# Altium schematic sheet Esquema_V3.SchDoc
size A3; SheetNumber: 1; SheetTotal: 2
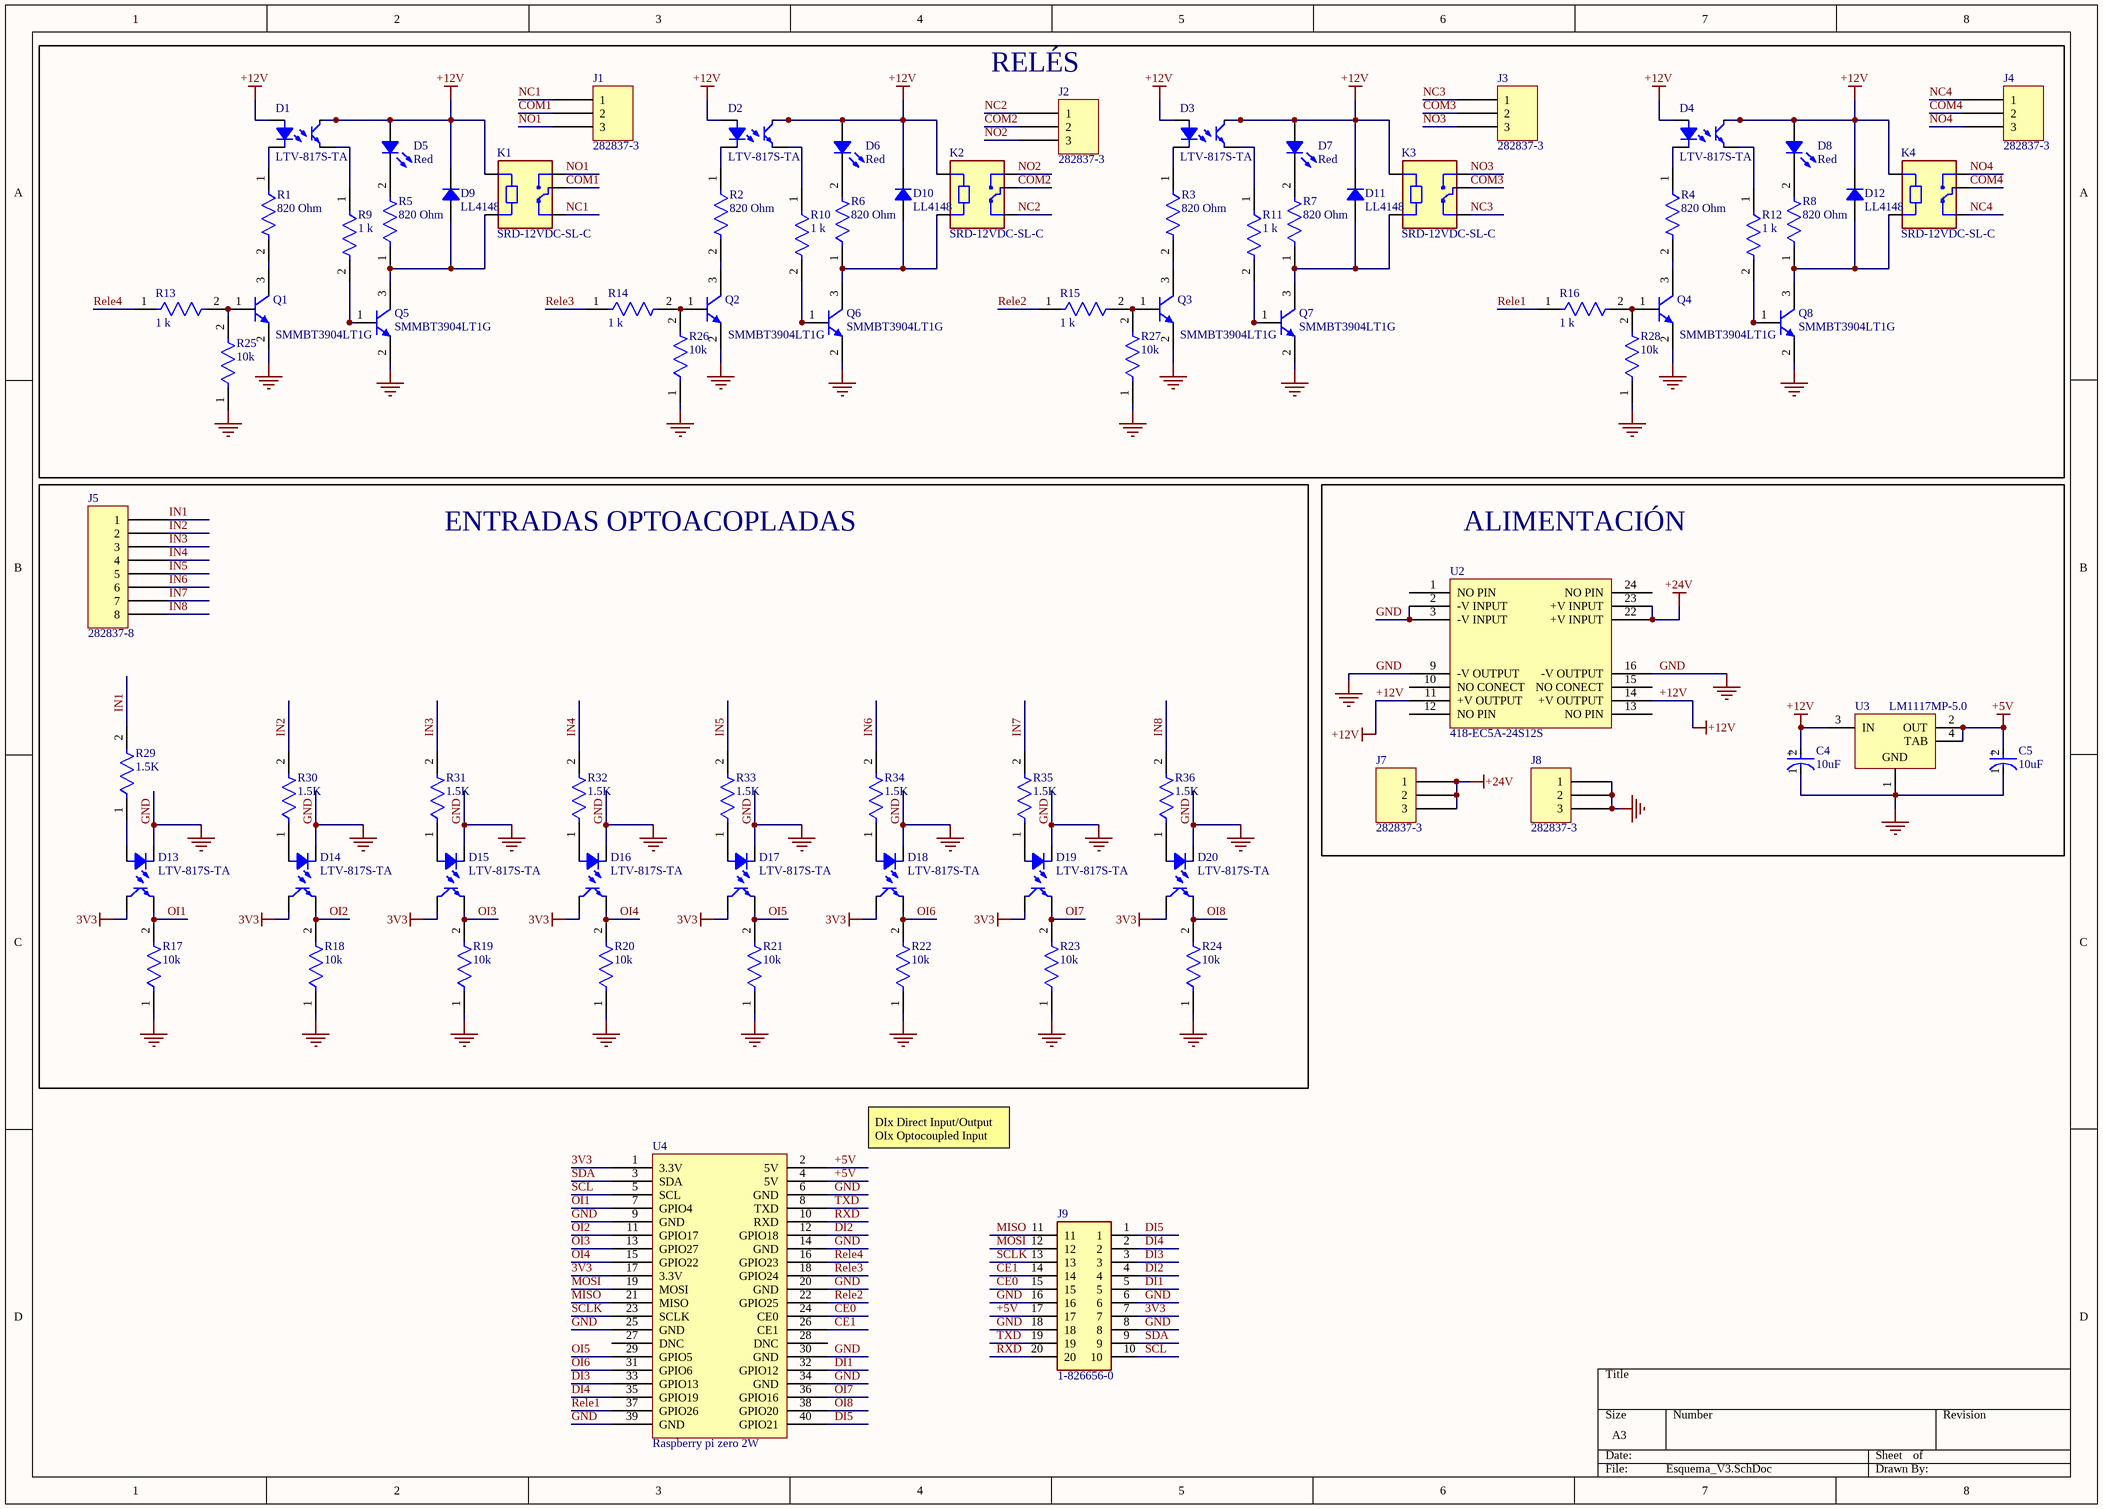
[diagram p0: Esquema_V3.SchDoc]

## Parts
C4  10uF  [FP-TAJA-MFG]
C5  10uF  [FP-TAJA-MFG]
D1  LTV-817S-TA  [LITEON LTV-817]
D2  LTV-817S-TA  [LITEON LTV-817]
D3  LTV-817S-TA  [LITEON LTV-817]
D4  LTV-817S-TA  [LITEON LTV-817]
D5  Red  [LED 1206_3216 RED]
D6  Red  [LED 1206_3216 RED]
D7  Red  [LED 1206_3216 RED]
D8  Red  [LED 1206_3216 RED]
D9  LL4148  [SOD-80 MiniMELF]
D10  LL4148  [SOD-80 MiniMELF]
D11  LL4148  [SOD-80 MiniMELF]
D12  LL4148  [SOD-80 MiniMELF]
D13  LTV-817S-TA  [LITEON LTV-817]
D14  LTV-817S-TA  [LITEON LTV-817]
D15  LTV-817S-TA  [LITEON LTV-817]
D16  LTV-817S-TA  [LITEON LTV-817]
D17  LTV-817S-TA  [LITEON LTV-817]
D18  LTV-817S-TA  [LITEON LTV-817]
D19  LTV-817S-TA  [LITEON LTV-817]
D20  LTV-817S-TA  [LITEON LTV-817]
J1  282837-3  [TE 282837-3]
J2  282837-3  [TE 282837-3]
J3  282837-3  [TE 282837-3]
J4  282837-3  [TE 282837-3]
J5  282837-8  [TE 282837-8]
J7  282837-3  [TE 282837-3]
J8  282837-3  [TE 282837-3]
J9  1-826656-0  [TE_1-826656-0]
K1  SRD-12VDC-SL-C  [RELAY_SRD-05VDC-SL-C]
K2  SRD-12VDC-SL-C  [RELAY_SRD-05VDC-SL-C]
K3  SRD-12VDC-SL-C  [RELAY_SRD-05VDC-SL-C]
K4  SRD-12VDC-SL-C  [RELAY_SRD-05VDC-SL-C]
Q1  SMMBT3904LT1G  [ONSC-SOT-23-3-318-08_V]
Q2  SMMBT3904LT1G  [ONSC-SOT-23-3-318-08_V]
Q3  SMMBT3904LT1G  [ONSC-SOT-23-3-318-08_V]
Q4  SMMBT3904LT1G  [ONSC-SOT-23-3-318-08_V]
Q5  SMMBT3904LT1G  [ONSC-SOT-23-3-318-08_V]
Q6  SMMBT3904LT1G  [ONSC-SOT-23-3-318-08_V]
Q7  SMMBT3904LT1G  [ONSC-SOT-23-3-318-08_V]
Q8  SMMBT3904LT1G  [ONSC-SOT-23-3-318-08_V]
R1  820 Ohm  [FP-CRCW0603-HPe3-MFG]
R2  820 Ohm  [FP-CRCW0603-HPe3-MFG]
R3  820 Ohm  [FP-CRCW0603-HPe3-MFG]
R4  820 Ohm  [FP-CRCW0603-HPe3-MFG]
R5  820 Ohm  [FP-CRCW0603-HPe3-MFG]
R6  820 Ohm  [FP-CRCW0603-HPe3-MFG]
R7  820 Ohm  [FP-CRCW0603-HPe3-MFG]
R8  820 Ohm  [FP-CRCW0603-HPe3-MFG]
R9  1 k  [FP-MCT0603-IPC_C]
R10  1 k  [FP-MCT0603-IPC_C]
R11  1 k  [FP-MCT0603-IPC_C]
R12  1 k  [FP-MCT0603-IPC_C]
R13  1 k  [FP-MCT0603-IPC_C]
R14  1 k  [FP-MCT0603-IPC_C]
R15  1 k  [FP-MCT0603-IPC_C]
R16  1 k  [FP-MCT0603-IPC_C]
R17  10k  [FP-MCT0603-IPC_B]
R18  10k  [FP-MCT0603-IPC_B]
R19  10k  [FP-MCT0603-IPC_B]
R20  10k  [FP-MCT0603-IPC_B]
R21  10k  [FP-MCT0603-IPC_B]
R22  10k  [FP-MCT0603-IPC_B]
R23  10k  [FP-MCT0603-IPC_B]
R24  10k  [FP-MCT0603-IPC_B]
R25  10k  [FP-MCT0603-IPC_B]
R26  10k  [FP-MCT0603-IPC_B]
R27  10k  [FP-MCT0603-IPC_B]
R28  10k  [FP-MCT0603-IPC_B]
R29  1.5K  [FP-CRCW0603-e3-IPC_C]
R30  1.5K  [FP-CRCW0603-e3-IPC_C]
R31  1.5K  [FP-CRCW0603-e3-IPC_C]
R32  1.5K  [FP-CRCW0603-e3-IPC_C]
R33  1.5K  [FP-CRCW0603-e3-IPC_C]
R34  1.5K  [FP-CRCW0603-e3-IPC_C]
R35  1.5K  [FP-CRCW0603-e3-IPC_C]
R36  1.5K  [FP-CRCW0603-e3-IPC_C]
U2  418-EC5A-24S12S  [418-EC5A-24S12S]
U3  LM1117MP-5.0  [MP04A_N]
U4  Raspberry pi zero 2W  [PCBComponent_1]

## Blocks framed on the sheet
RELÉS: D1-D12 J1-J4 K1-K4 Q1-Q8 R1-R16 R25-R28
ENTRADAS OPTOACOPLADAS: D13-D20 J5 R17-R24 R29-R36
ALIMENTACIÓN: C4 C5 J7 J8 U2 U3

## Nets
3V3: D13.4 D14.4 D15.4 D16.4 D17.4 D18.4 D19.4 D20.4 J9.7 U4.1(3.3V) U4.17(3.3V)
+5V: C5.2(A) J9.17 U3.2(OUT) U3.4(TAB) U4.2(5V) U4.4(5V)
+12V: C4.2(A) D1.1 D1.4 D2.1 D2.4 D3.1 D3.4 D4.1 D4.4 D5.1 D6.1 D7.1 D8.1 D9.2 D10.2 D11.2 D12.2 K1.A1 K2.A1 K3.A1 K4.A1 U2.11(+V_OUTPUT) U2.14(+V_OUTPUT) U3.3(IN)
+24V: J7.1 J7.2 J7.3 U2.22(+V_INPUT) U2.23(+V_INPUT)
GND: C4.1(C) C5.1(C) D13.2 D14.2 D15.2 D16.2 D17.2 D18.2 D19.2 D20.2 J8.1 J8.2 J8.3 J9.6 J9.8 J9.16 J9.18 Q1.2(E) Q2.2(E) Q3.2(E) Q4.2(E) Q5.2(E) Q6.2(E) Q7.2(E) Q8.2(E) R17.1 R18.1 R19.1 R20.1 R21.1 R22.1 R23.1 R24.1 R25.1 R26.1 R27.1 R28.1 U2.2(-V_INPUT) U2.3(-V_INPUT) U2.9(-V_OUTPUT) U2.16(-V_OUTPUT) U3.1(GND) U4.6(GND) U4.9(GND) U4.14(GND) U4.20(GND) U4.25(GND) U4.30(GND) U4.34(GND) U4.39(GND)
CE0: J9.15 U4.24(CE0)
CE1: J9.14 U4.26(CE1)
COM1: J1.2 K1.COM
COM2: J2.2 K2.COM
COM3: J3.2 K3.COM
COM4: J4.2 K4.COM
DI1: J9.5 U4.32(GPIO12)
DI2: J9.4 U4.12(GPIO18)
DI3: J9.3 U4.33(GPIO13)
DI4: J9.2 U4.35(GPIO19)
DI5: J9.1 U4.40(GPIO21)
IN1: J5.1 R29.2
IN2: J5.2 R30.2
IN3: J5.3 R31.2
IN4: J5.4 R32.2
IN5: J5.5 R33.2
IN6: J5.6 R34.2
IN7: J5.7 R35.2
IN8: J5.8 R36.2
MISO: J9.11 U4.21(MISO)
MOSI: J9.12 U4.19(MOSI)
NC1: J1.1 K1.NC
NC2: J2.1 K2.NC
NC3: J3.1 K3.NC
NC4: J4.1 K4.NC
NO1: J1.3 K1.NO
NO2: J2.3 K2.NO
NO3: J3.3 K3.NO
NO4: J4.3 K4.NO
OI1: D13.3 R17.2 U4.7(GPIO4)
OI2: D14.3 R18.2 U4.11(GPIO17)
OI3: D15.3 R19.2 U4.13(GPIO27)
OI4: D16.3 R20.2 U4.15(GPIO22)
OI5: D17.3 R21.2 U4.29(GPIO5)
OI6: D18.3 R22.2 U4.31(GPIO6)
OI7: D19.3 R23.2 U4.36(GPIO16)
OI8: D20.3 R24.2 U4.38(GPIO20)
Rele1: R16.1 U4.37(GPIO26)
Rele2: R15.1 U4.22(GPIO25)
Rele3: R14.1 U4.18(GPIO24)
Rele4: R13.1 U4.16(GPIO23)
RXD: J9.20 U4.10(RXD)
SCL: J9.10 U4.5(SCL)
SCLK: J9.13 U4.23(SCLK)
SDA: J9.9 U4.3(SDA)
TXD: J9.19 U4.8(TXD)
NetD1_2: D1.2 R1.1
NetD1_3: D1.3 R9.1
NetD2_2: D2.2 R2.1
NetD2_3: D2.3 R10.1
NetD3_2: D3.2 R3.1
NetD3_3: D3.3 R11.1
NetD4_2: D4.2 R4.1
NetD4_3: D4.3 R12.1
NetD5_2: D5.2 R5.2
NetD6_2: D6.2 R6.2
NetD7_2: D7.2 R7.2
NetD8_2: D8.2 R8.2
NetD9_1: D9.1 K1.A2 Q5.3(C) R5.1
NetD10_1: D10.1 K2.A2 Q6.3(C) R6.1
NetD11_1: D11.1 K3.A2 Q7.3(C) R7.1
NetD12_1: D12.1 K4.A2 Q8.3(C) R8.1
NetD13_1: D13.1 R29.1
NetD14_1: D14.1 R30.1
NetD15_1: D15.1 R31.1
NetD16_1: D16.1 R32.1
NetD17_1: D17.1 R33.1
NetD18_1: D18.1 R34.1
NetD19_1: D19.1 R35.1
NetD20_1: D20.1 R36.1
NetQ1_1: Q1.1(B) R13.2 R25.2
NetQ1_3: Q1.3(C) R1.2
NetQ2_1: Q2.1(B) R14.2 R26.2
NetQ2_3: Q2.3(C) R2.2
NetQ3_1: Q3.1(B) R15.2 R27.2
NetQ3_3: Q3.3(C) R3.2
NetQ4_1: Q4.1(B) R16.2 R28.2
NetQ4_3: Q4.3(C) R4.2
NetQ5_1: Q5.1(B) R9.2
NetQ6_1: Q6.1(B) R10.2
NetQ7_1: Q7.1(B) R11.2
NetQ8_1: Q8.1(B) R12.2

Not connected (* = marked no-connect by the designer): U2 1(NO_PIN) 10(NO_CONECT) 12(NO_PIN) 13(NO_PIN) 15(NO_CONECT) 24(NO_PIN); U4 27(DNC) 28(DNC)

## Notes on the sheet
- DIx Direct Input/Output
  OIx Optocoupled Input
- (in symbol CMP-2000-07219-2) +

## Library data of the parts
C4 C5 = CMP-2000-07219-2: TAJA106M010RNJ 10uF 10V  ±20% 3Ω 1206  SMD Tantalum Capacitor; Polarity: Polar; ESR (Equivalent Series Resistance): 3R; Dissipation Factor: 6%; Leakage Current: 1uA; Construction: Flat; Packaging: Tape and Reel; Voltage Rating: 10V; Lead Free: Lead Free; Radiation Hardening: No; REACH SVHC: No SVHC; Termination: SMD/SMT; Case/Package: 1206; RoHS Compliant: Yes; Min Operating Temperature: -55°C; Depth: 1.6mm; Voltage Rating (DC): 10V; Series: TAJ; Capacitance: 10uF; Height: 1.6mm; Height - Seated (Max): 0.071inch; Tolerance: 20%; Package Quantity: 1; Voltage: 10V; Features: General Purpose; Max Operating Temperature: 125°C; Lead Pitch: 1.1mm; Dielectric Material: Tantalum; Width: 0.063inch; Mount: Surface Mount; Case Code (Metric): 3216; Case Code (Imperial): 1206; Length: 3.2mm; Number of Pins: 2
D1-D4 D13-D20 = LTV-817S-TA: OPTOISOLATR 5KV TRANSISTOR 4-SMD; Manufacturer: Lite-On Inc.; Current - DC Forward (If) (Max): 50mA; Current Transfer Ratio (Max): 600% @ 5mA; Current Transfer Ratio (Min): 50% @ 5mA; Input Type: DC; Number of Channels: 1; Rise / Fall Time (Typ): 4µs, 3µs; Vce Saturation (Max): 200mV; Voltage - Forward (Vf) (Typ): 1.2V; Voltage - Isolation: 5000Vrms; Voltage - Output (Max): 35V; Part Number: LTV-817S-TA; ComponentLink1Description: Datasheet; ComponentLink1URL: http://optoelectronics.liteon.com/upload/download/DS-70-96-0016/LTV-8X7%20series%20201610%20.pdf; ComponentLink2Description: DigiKey Link; ComponentLink2URL: http://digikey.com/product-detail/en/lite-on-inc/LTV-817S-TA/160-2038-1-ND/3711420; Current - Output / Channel: 50mA; Device Package: 4-SMD, Gull Wing; LastUpdated: 12/01/2020 21:59:02; Lifecycle Status: Active; Minimum Order: 1; Mounting Type: Surface Mount; Operating Temperature: -30°C ~ 110°C; Output Type: Transistor; Package / Case: 4-SMD, Gull Wing; Packaging: TapeAndReel; Part Status: Active; Price: 0.12; Series: -; Supplier 1: DigiKey; Supplier Part Number 1: 160-2038-1-ND; Supplier Device Package: 4-SMD
D5-D8 = LTST-C150KAKT: LED RED CLEAR SMD; Manufacturer: Lite-On Inc.; Configuration: Standard; Current - Test: 20mA; Lens Color: Colorless; Lens Size: 2.06mm x 1.60mm; Lens Style: Rectangle with Flat Top; Millicandela Rating: 55mcd; Viewing Angle: 130°; Voltage - Forward (Vf) (Typ): 2V; Wavelength - Dominant: 615nm; Wavelength - Peak: 621nm; Part Number: LTST-C150KAKT; Color: Red; ComponentLink1Description: Datasheet; ComponentLink1URL: //media.digikey.com/pdf/Data%20Sheets/Lite-On%20PDFs/LTST-C150KAKT.pdf; ComponentLink2Description: DigiKey Link; ComponentLink2URL: http://digikey.com/product-detail/en/lite-on-inc/LTST-C150KAKT/160-1402-1-ND/386755; Device Package: 1206 (3216 Metric); Height (Max): 1.10mm; LastUpdated: 03/06/2024 20:00:41; Lens Transparency: Clear; Lifecycle Status: Active; Minimum Order: 1; Mounting Type: Surface Mount; Package / Case: 1206 (3216 Metric); Packaging: TapeAndReel; PartId: 189; Part Status: Active; Price: 0.07; Series: -; Size / Dimension: 3.20mm L x 1.60mm W; Supplier 1: DigiKey; Supplier Part Number 1: 160-1402-1-ND; Value: Red
D9-D12 = LL4148: DIODE GEN PURP 100V 200MA SOD80; Manufacturer: ON Semiconductor; Current - Reverse Leakage @ Vr: 25nA @ 20V; Diode Type: Standard; Reverse Recovery Time (trr): 4ns; Speed: Small Signal =< 200mA (Io), Any Speed; Voltage - Forward (Vf) (Max) @ If: 1V @ 10mA; Part Number: LL4148; ComponentLink1Description: Datasheet; ComponentLink1URL: https://www.onsemi.com/pub/Collateral/LL4148-D.pdf; ComponentLink2Description: DigiKey Link; ComponentLink2URL: http://digikey.com/product-detail/en/on-semiconductor/LL4148/LL4148FSCT-ND/1923118; Current - Average Rectified (Io): 200mA; LastUpdated: 03/06/2024 20:05:39; Lifecycle Status: Active; Minimum Order: 1; Mounting Type: Surface Mount; Operating Temperature - Junction: -55°C ~ 175°C; Package / Case: DO-213AC, MINI-MELF, SOD-80; Packaging: TapeAndReel; PartId: 2621; Part Status: Active; Price: 0.02; Series: -; Supplier 1: DigiKey; Supplier Part Number 1: LL4148FSCT-ND; Supplier Device Package: SOD-80; Voltage - DC Reverse (Vr) (Max): 100V
J1-J4 J7 J8 = 282837-3: TERM BLK 3P SIDE ENT 5.08MM PCB; Manufacturer: TE Connectivity AMP Connectors; Current: 13.5 A; Mating Orientation: Horizontal with Board; Number of Levels: 1; Pitch: 0.200" (5.08mm); Positions Per Level: 3; Voltage: 300 V; Wire Gauge: 16-28 AWG; Wire Termination: Screw - Rising Cage Clamp; Part Number: 282837-3; Color: Green; ComponentLink1Description: Datasheet; ComponentLink1URL: https://www.te.com/commerce/DocumentDelivery/DDEController?Action=srchrtrv&DocNm=282837&DocType=Customer+Drawing&DocLang=English; ComponentLink2Description: DigiKey Link; ComponentLink2URL: https://www.digikey.com/en/products/detail/te-connectivity-amp-connectors/282837-3/2187974; Features: Interlocking (Side); LastUpdated: 21/06/2022 15:00:39; Lifecycle Status: Active; Minimum Order: 1; Mounting Type: Through Hole; Packaging: Tray; Part Status: Active; Price: 0.47; Series: Buchanan; Supplier 1: DigiKey; Supplier Part Number 1: A113321-ND
J5 = 282837-8: TERM BLK 8P SIDE ENT 5.08MM PCB; Manufacturer: TE Connectivity AMP Connectors; Current: 13.5 A; Mating Orientation: Horizontal with Board; Number of Levels: 1; Pitch: 0.200" (5.08mm); Positions Per Level: 8; Voltage: 300 V; Wire Gauge: 16-28 AWG; Wire Termination: Screw - Rising Cage Clamp; Part Number: 282837-8; Color: Green; ComponentLink1Description: Datasheet; ComponentLink1URL: https://www.te.com/commerce/DocumentDelivery/DDEController?Action=srchrtrv&DocNm=282837&DocType=Customer+Drawing&DocLang=English; ComponentLink2Description: DigiKey Link; ComponentLink2URL: https://www.digikey.com/en/products/detail/te-connectivity-amp-connectors/282837-8/2222331; Features: Interlocking (Side); LastUpdated: 21/06/2022 15:01:52; Lifecycle Status: Active; Minimum Order: 1; Mounting Type: Through Hole; Packaging: Bulk; Part Status: Active; Price: 1.64; Series: Buchanan; Supplier 1: DigiKey; Supplier Part Number 1: 282837-8-ND
J9 = 1-826656-0: Conn Unshrouded Header HDR 20 POS 2.54mm Solder ST Thru-Hole Box; MF: TE Connectivity; Purchase-URL: https://pricing.snapeda.com/search/part/1-826656-0/?ref=eda; Value: *; SnapEDA_Link: https://www.snapeda.com/parts/1-826656-0/TE%20Connectivity%20AMP%20Connectors/view-part/2881856/?ref=snap; Package: None; Availability: Good; Price: None; Check_prices: https://www.snapeda.com/parts/1-826656-0/TE%20Connectivity%20AMP%20Connectors/view-part/2881856/?ref=eda; MP: 1-826656-0
K1-K4 = SRD-05VDC-SL-C: 5V Trigger Relay Module For Arduino And Raspberry Pi 5V Trigger Relay Module For Arduino And Raspberry Pi; MF: Songle Relay; Check_prices: https://www.snapeda.com/parts/SRD-05VDC-SL-C/Songle+Relay/view-part/?ref=eda; Value: *; Availability: Not in stock; Price: None; Package: NON STANDARD-5 Songle Relay; MP: SRD-05VDC-SL-C; SnapEDA_Link: https://www.snapeda.com/parts/SRD-05VDC-SL-C/Songle+Relay/view-part/?ref=snap
Q1-Q8 = CMP-1048-00625-1: General Purpose Transistor, NPN Silicon, 3-Pin SOT-23, Pb-Free, Tape and Reel; Manufacturer: On Semiconductor; IC Continuous (A): 0.2; fT Min (MHz): 300; PackageDescription: 3-Pin Small Outline Transistor, Body 2.92 x 1.3 mm, Pitch 0.95 mm; Mounting Technology: Surface Mount; ComponentLink1Description: Manufacturer URL; DatasheetVersion: Rev. 12; PackageReference: SOT-23-3-318-08; ComponentLink1URL: http://www.onsemi.com/; ComponentLink3Description: Package Specification; RoHS: TRUE; PartNumber: SMMBT3904LT1G; Polarity: NPN; Packing: Tape and Reel; ComponentLink2URL: http://www.onsemi.cn/pub_link/Collateral/MMBT3904LT1-D.PDF; PackageVersion: Rev. AP, 11/2009; ComponentLink2Description: Datasheet; ComponentLink3URL: http://www.onsemi.cn/pub_link/Collateral/318-08.PDF
R1-R8 = CMP-02407-003128-1: RES Thick Film, 820Ω, 1%, 0.33W, 100ppm/°C, 0603; Voltage Rating: 75V; Max Power Dissipation: 250mW; Resistance: 820R; Temperature Coefficient: 100ppm/°C; Termination: SMD/SMT; Military Standard: Not; Features: Automotive AEC-Q200; Composition: Thick Film; Voltage Rating (DC): 75V; Contact Plating: Tin; Package Quantity: 1; Case Code (Metric): 1608; Width: 0.033inch; Case/Package: 0603; Packaging: Tape and Reel; Depth: 0.85mm; Lead Free: Lead Free; Tolerance: 1%; Length: 1.6mm; Power Rating: 250mW; Weight: 7.1E-05oz; Case Code (Imperial): 0603; Radiation Hardening: No; Number of Terminations: 2; Max Operating Temperature: 155°C; Height: 0.45mm; Min Operating Temperature: -55°C
R9-R16 = CMP-02407-000265-1: MCT0603PD1001DP500 RES SMD 100 OHM 1% 1/8W 0603; Resistance: 1kR; Temperature Coefficient: 25ppm/°C; Tolerance: 0.5%; Max Power Dissipation: 250mW; Case Code (Metric): 1608; Case Code (Imperial): 0603; Number of Terminations: 2; Case/Package: 0603; Features: Automotive AEC-Q200; Max Operating Temperature: 175°C; Min Operating Temperature: -55°C; Composition: Thin Film; Packaging: Tape and Reel
R17-R28 = CMP-02407-000530-1: MCT0603MD1002BP100 RES SMD 10k OHM 1% 1/8W 0603; Resistance: 10kR; Voltage Rating (DC): 75V; Max Power Dissipation: 125mW; Tolerance: 0.1%; Temperature Coefficient: 25ppm/°C; Max Operating Temperature: 155°C; Case/Package: 0603; Contact Plating: Tin; Military Standard: Not; Number of Terminations: 2; Min Operating Temperature: -55°C; Radiation Hardening: No; Lead Free: Lead Free; Case Code (Imperial): 0603; Length: 1.55mm; Voltage Rating: 75V; Height: 0.45mm; Features: Automotive AEC-Q200; Case Code (Metric): 1608; REACH SVHC: No SVHC; Packaging: Tape and Reel; Depth: 0.85mm; Width: 0.033inch; Package Quantity: 1; Composition: Thin Film; Power Rating: 125mW
R29-R36 = CMP-02407-004713-1: CRCW06031K50FKEC RES Thick Film, 1.5kΩ, 1%, 0.1W, 100ppm/°C, 0603; Resistance: 1.5kR; Max Power Dissipation: 100mW; Military Standard: Not; Packaging: Tape and Reel; Min Operating Temperature: -55°C; Composition: Thick Film; Features: Automotive AEC-Q200; Width: 0.033inch; Package Quantity: 20000; Depth: 0.85mm; Max Operating Temperature: 155°C; Case/Package: 0603; Height: 0.02inch; Number of Terminations: 2; Lead Free: Lead Free; Tolerance: 1%; Length: 0.061inch; Temperature Coefficient: 100ppm/°C
U3 = CMP-0062-01640-3: 800mA Low-Dropout Linear Regulator, 4-pin SOT-223; Manufacturer: National Semiconductor; CompType: LDO IC; PackageTopMarking: XYTT*N06A; High-Reliability: Y; PowerWise: N; Code_IPC: SOT223-4; PackageVersion: revB, Apr-2003; RoHS: N; Code_JEDEC: TO-261-AA; PinCount: 4; ComponentLink1URL: http://www.national.com/; ComponentLink4URL: http://www.national.com/packaging/folders/mp04a.html; RevisionNote: SCH symbol layout adjusted; PackageDescription: Molded SOT-223, 6.50 x 3.56 x 1.6mm Body, 4 Lead, 2.3mm Pitch; DatasheetVersion: Apr-2006; ComponentLink3URL: http://www.national.com/pf/LM/LM1117.html; ComponentLink2URL: http://www.national.com/ds/LM/LM1117.pdf; PartNumber: LM1117MP-5.0; ComponentLink2Description: LM1117 Datasheet; ComponentLink3Description: LM1117 Web Page; ComponentLink4Description: MP04A Package Page; PackageReference: MP04A; ComponentLink1Description: Manufacturer URL